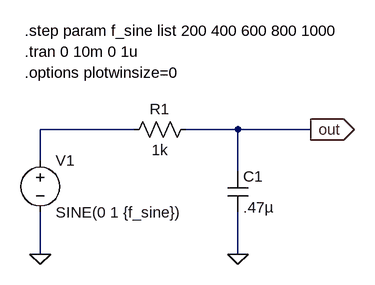
[diagram p0: schematic stepped_plot_panes.asc]
stepped_plot_panes.asc, the LTspice schematic file:
Version 4
SHEET 1 880 680
WIRE 112 208 -32 208
WIRE 272 208 192 208
WIRE 384 208 272 208
WIRE -32 256 -32 208
WIRE 272 272 272 208
WIRE -32 400 -32 336
WIRE 272 400 272 336
FLAG -32 400 0
FLAG 272 400 0
FLAG 384 208 out
IOPIN 384 208 Out
SYMBOL voltage -32 240 R0
WINDOW 123 0 0 Left 0
WINDOW 39 0 0 Left 0
SYMATTR InstName V1
SYMATTR Value SINE(0 1 {f_sine})
SYMBOL res 96 224 R270
WINDOW 0 32 56 VTop 0
WINDOW 3 0 56 VBottom 0
SYMATTR InstName R1
SYMATTR Value 1k
SYMBOL cap 256 272 R0
SYMATTR InstName C1
SYMATTR Value .47µ
TEXT -56 56 Left 0 !.step param f_sine list 200 400 600 800 1000
TEXT -56 88 Left 0 !.tran 0 10m 0 1u
TEXT -56 120 Left 0 !.options plotwinsize=0

The netlist it stands for:
* stepped_plot_panes.asc
V1 N001 0 SINE(0 1 {f_sine})
R1 N001 out 1k
C1 out 0 .47µ
.step param f_sine list 200 400 600 800 1000
.tran 0 10m 0 1u
.options plotwinsize=0
.backanno
.end